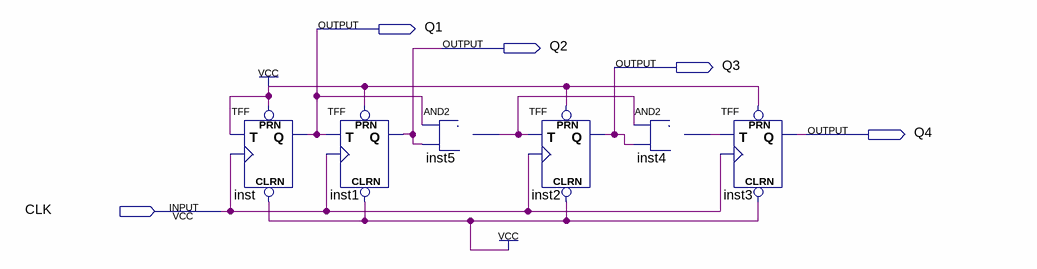
[diagram p0: schematic sheet]
// Quartus schematic lab10step2.bdf as structural Verilog: 6 symbols, 5 pins
module lab10step2 (
  input  CLK,
  output Q1,
  output Q2,
  output Q3,
  output Q4
);

  wire inst4_out, inst5_out;

  TFF inst (.PRN(1'b1), .CLRN(1'b1), .T(1'b1), .CLK(CLK), .Q(Q1));
  TFF inst1 (.PRN(1'b1), .CLRN(1'b1), .T(Q1), .CLK(CLK), .Q(Q2));
  and inst5 (inst5_out, Q1, Q2);
  TFF inst2 (.PRN(1'b1), .CLRN(1'b1), .T(inst5_out), .CLK(CLK), .Q(Q3));
  and inst4 (inst4_out, inst5_out, Q3);
  TFF inst3 (.PRN(1'b1), .CLRN(1'b1), .T(inst4_out), .CLK(CLK), .Q(Q4));
endmodule
